# Altium schematic sheet Sheet3.SchDoc
size 300 x 250 mm; SheetNumber: 3; SheetTotal: 3
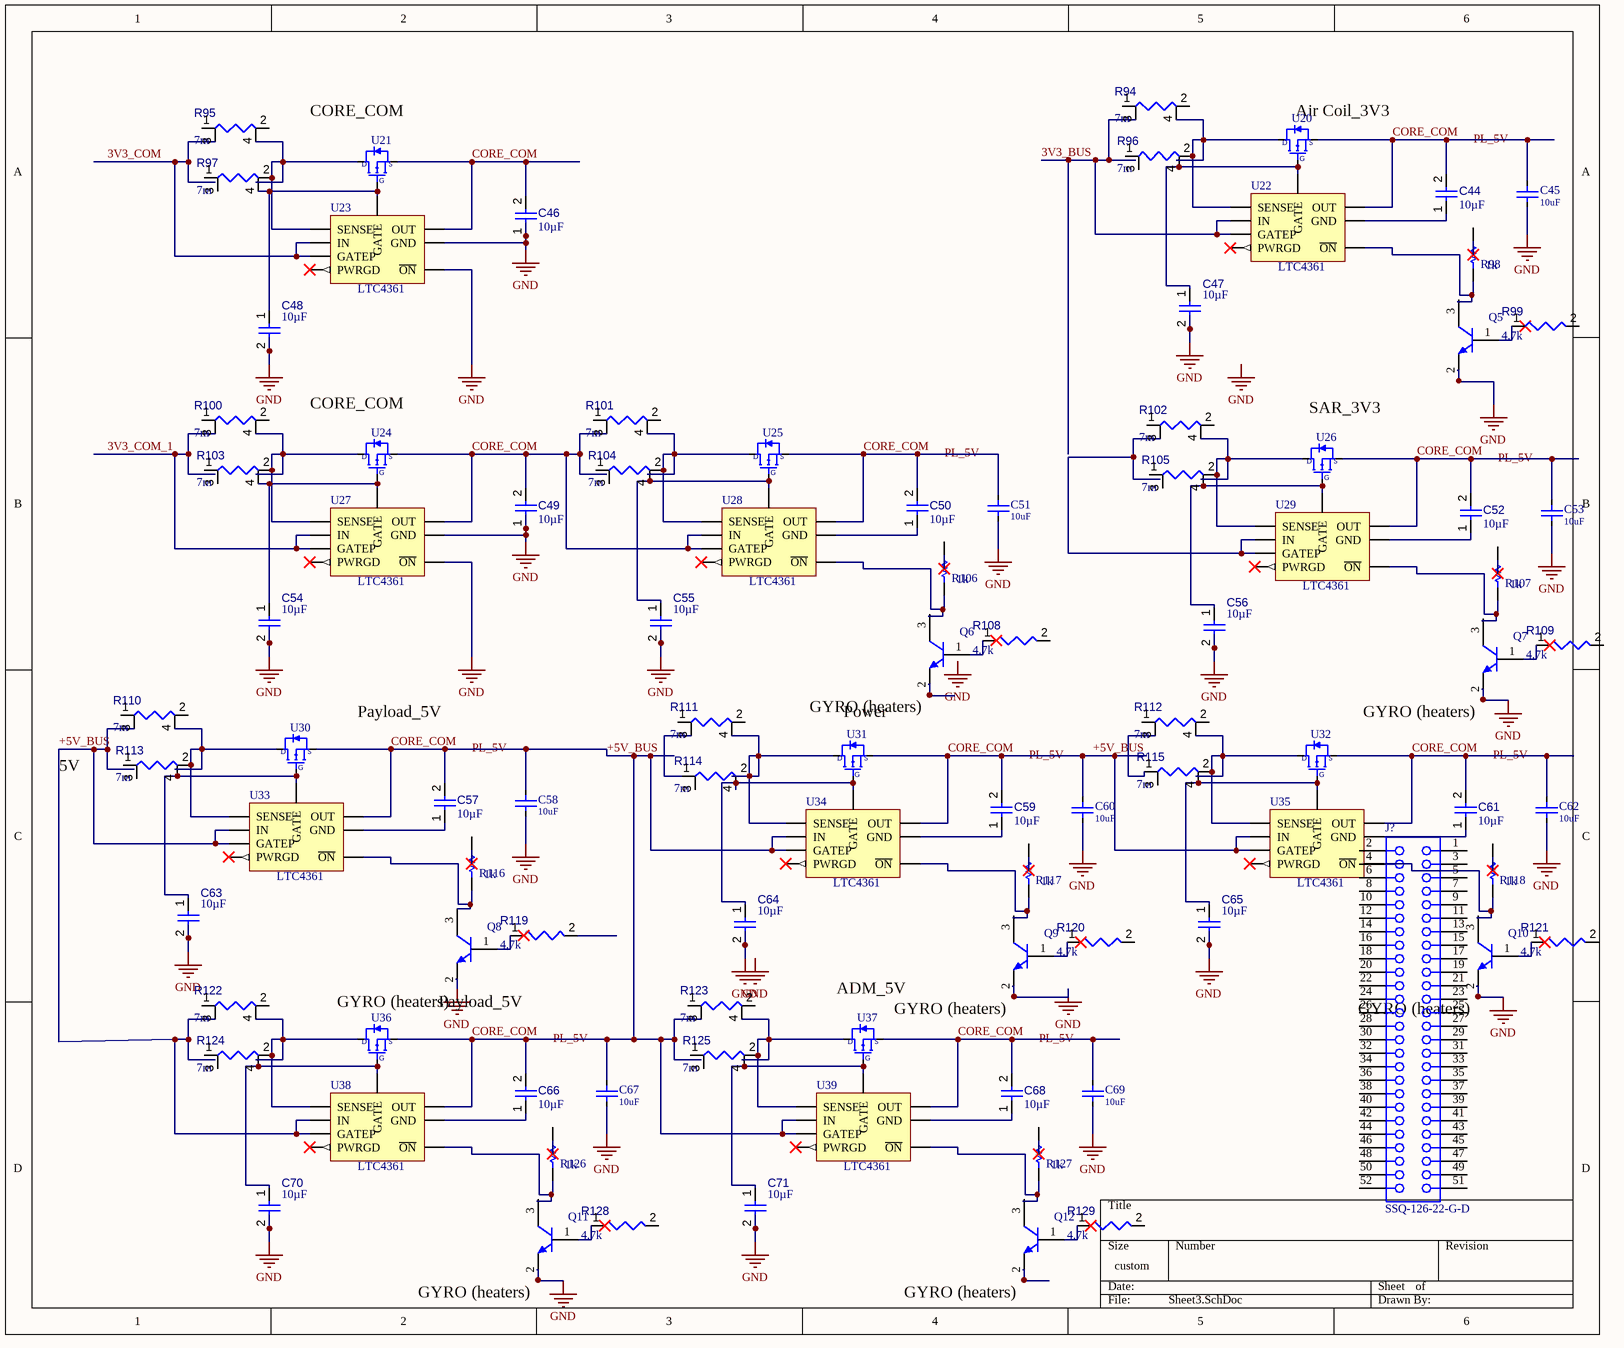
[diagram p0: Sheet3.SchDoc]

## Parts
C44  value 10µF  [CAPC0805(2012)145_L]  (hidden comment: Capacitor 10µF +/-20% 25V 0805)
C45  value 10uF  [CL21B106KOQNNNE]  (hidden comment: CL21B106KOQNNNE)
C46  value 10µF  [CAPC0805(2012)145_L]  (hidden comment: Capacitor 10µF +/-20% 25V 0805)
C47  value 10µF  [CAPC0805(2012)145_L]  (hidden comment: Capacitor 10µF +/-20% 25V 0805)
C48  value 10µF  [CAPC0805(2012)145_L]  (hidden comment: Capacitor 10µF +/-20% 25V 0805)
C49  value 10µF  [CAPC0805(2012)145_L]  (hidden comment: Capacitor 10µF +/-20% 25V 0805)
C50  value 10µF  [CAPC0805(2012)145_L]  (hidden comment: Capacitor 10µF +/-20% 25V 0805)
C51  value 10uF  [CL21B106KOQNNNE]  (hidden comment: CL21B106KOQNNNE)
C52  value 10µF  [CAPC0805(2012)145_L]  (hidden comment: Capacitor 10µF +/-20% 25V 0805)
C53  value 10uF  [CL21B106KOQNNNE]  (hidden comment: CL21B106KOQNNNE)
C54  value 10µF  [CAPC0805(2012)145_L]  (hidden comment: Capacitor 10µF +/-20% 25V 0805)
C55  value 10µF  [CAPC0805(2012)145_L]  (hidden comment: Capacitor 10µF +/-20% 25V 0805)
C56  value 10µF  [CAPC0805(2012)145_L]  (hidden comment: Capacitor 10µF +/-20% 25V 0805)
C57  value 10µF  [CAPC0805(2012)145_L]  (hidden comment: Capacitor 10µF +/-20% 25V 0805)
C58  value 10uF  [CL21B106KOQNNNE]  (hidden comment: CL21B106KOQNNNE)
C59  value 10µF  [CAPC0805(2012)145_L]  (hidden comment: Capacitor 10µF +/-20% 25V 0805)
C60  value 10uF  [CL21B106KOQNNNE]  (hidden comment: CL21B106KOQNNNE)
C61  value 10µF  [CAPC0805(2012)145_L]  (hidden comment: Capacitor 10µF +/-20% 25V 0805)
C62  value 10uF  [CL21B106KOQNNNE]  (hidden comment: CL21B106KOQNNNE)
C63  value 10µF  [CAPC0805(2012)145_L]  (hidden comment: Capacitor 10µF +/-20% 25V 0805)
C64  value 10µF  [CAPC0805(2012)145_L]  (hidden comment: Capacitor 10µF +/-20% 25V 0805)
C65  value 10µF  [CAPC0805(2012)145_L]  (hidden comment: Capacitor 10µF +/-20% 25V 0805)
C66  value 10µF  [CAPC0805(2012)145_L]  (hidden comment: Capacitor 10µF +/-20% 25V 0805)
C67  value 10uF  [CL21B106KOQNNNE]  (hidden comment: CL21B106KOQNNNE)
C68  value 10µF  [CAPC0805(2012)145_L]  (hidden comment: Capacitor 10µF +/-20% 25V 0805)
C69  value 10uF  [CL21B106KOQNNNE]  (hidden comment: CL21B106KOQNNNE)
C70  value 10µF  [CAPC0805(2012)145_L]  (hidden comment: Capacitor 10µF +/-20% 25V 0805)
C71  value 10µF  [CAPC0805(2012)145_L]  (hidden comment: Capacitor 10µF +/-20% 25V 0805)
J?  SSQ-126-22-G-D  [SAMTEC_SSQ-126-X-G-D]
Q5  MMBT3904  [FAIR-SOT23-3_V]  (value not drawn)
Q6  MMBT3904  [FAIR-SOT23-3_V]  (value not drawn)
Q7  MMBT3904  [FAIR-SOT23-3_V]  (value not drawn)
Q8  MMBT3904  [FAIR-SOT23-3_V]  (value not drawn)
Q9  MMBT3904  [FAIR-SOT23-3_V]  (value not drawn)
Q10  MMBT3904  [FAIR-SOT23-3_V]  (value not drawn)
Q11  MMBT3904  [FAIR-SOT23-3_V]  (value not drawn)
Q12  MMBT3904  [FAIR-SOT23-3_V]  (value not drawn)
R94  value 7m  [SUSUMU-3216T4A]  (hidden comment: Resistor 7mR +/-1% 1206 63 mW)
R95  value 7m  [SUSUMU-3216T4A]  (hidden comment: Resistor 7mR +/-1% 1206 63 mW)
R96  value 7m  [SUSUMU-3216T4A]  (hidden comment: Resistor 7mR +/-1% 1206 63 mW)
R97  value 7m  [SUSUMU-3216T4A]  (hidden comment: Resistor 7mR +/-1% 1206 63 mW)
R98  value 1k  [RESC1005X40X25ML05T05]  (hidden comment: Resistor 1k +/-1% 0402 100 mW)
R99  value 4.7k  [RESC2013X70X40ML20T20]  (hidden comment: Resistor 4k7 +/-1% 0805 125 mW)
R100  value 7m  [SUSUMU-3216T4A]  (hidden comment: Resistor 7mR +/-1% 1206 63 mW)
R101  value 7m  [SUSUMU-3216T4A]  (hidden comment: Resistor 7mR +/-1% 1206 63 mW)
R102  value 7m  [SUSUMU-3216T4A]  (hidden comment: Resistor 7mR +/-1% 1206 63 mW)
R103  value 7m  [SUSUMU-3216T4A]  (hidden comment: Resistor 7mR +/-1% 1206 63 mW)
R104  value 7m  [SUSUMU-3216T4A]  (hidden comment: Resistor 7mR +/-1% 1206 63 mW)
R105  value 7m  [SUSUMU-3216T4A]  (hidden comment: Resistor 7mR +/-1% 1206 63 mW)
R106  value 1k  [RESC1005X40X25ML05T05]  (hidden comment: Resistor 1k +/-1% 0402 100 mW)
R107  value 1k  [RESC1005X40X25ML05T05]  (hidden comment: Resistor 1k +/-1% 0402 100 mW)
R108  value 4.7k  [RESC2013X70X40ML20T20]  (hidden comment: Resistor 4k7 +/-1% 0805 125 mW)
R109  value 4.7k  [RESC2013X70X40ML20T20]  (hidden comment: Resistor 4k7 +/-1% 0805 125 mW)
R110  value 7m  [SUSUMU-3216T4A]  (hidden comment: Resistor 7mR +/-1% 1206 63 mW)
R111  value 7m  [SUSUMU-3216T4A]  (hidden comment: Resistor 7mR +/-1% 1206 63 mW)
R112  value 7m  [SUSUMU-3216T4A]  (hidden comment: Resistor 7mR +/-1% 1206 63 mW)
R113  value 7m  [SUSUMU-3216T4A]  (hidden comment: Resistor 7mR +/-1% 1206 63 mW)
R114  value 7m  [SUSUMU-3216T4A]  (hidden comment: Resistor 7mR +/-1% 1206 63 mW)
R115  value 7m  [SUSUMU-3216T4A]  (hidden comment: Resistor 7mR +/-1% 1206 63 mW)
R116  value 1k  [RESC1005X40X25ML05T05]  (hidden comment: Resistor 1k +/-1% 0402 100 mW)
R117  value 1k  [RESC1005X40X25ML05T05]  (hidden comment: Resistor 1k +/-1% 0402 100 mW)
R118  value 1k  [RESC1005X40X25ML05T05]  (hidden comment: Resistor 1k +/-1% 0402 100 mW)
R119  value 4.7k  [RESC2013X70X40ML20T20]  (hidden comment: Resistor 4k7 +/-1% 0805 125 mW)
R120  value 4.7k  [RESC2013X70X40ML20T20]  (hidden comment: Resistor 4k7 +/-1% 0805 125 mW)
R121  value 4.7k  [RESC2013X70X40ML20T20]  (hidden comment: Resistor 4k7 +/-1% 0805 125 mW)
R122  value 7m  [SUSUMU-3216T4A]  (hidden comment: Resistor 7mR +/-1% 1206 63 mW)
R123  value 7m  [SUSUMU-3216T4A]  (hidden comment: Resistor 7mR +/-1% 1206 63 mW)
R124  value 7m  [SUSUMU-3216T4A]  (hidden comment: Resistor 7mR +/-1% 1206 63 mW)
R125  value 7m  [SUSUMU-3216T4A]  (hidden comment: Resistor 7mR +/-1% 1206 63 mW)
R126  value 1k  [RESC1005X40X25ML05T05]  (hidden comment: Resistor 1k +/-1% 0402 100 mW)
R127  value 1k  [RESC1005X40X25ML05T05]  (hidden comment: Resistor 1k +/-1% 0402 100 mW)
R128  value 4.7k  [RESC2013X70X40ML20T20]  (hidden comment: Resistor 4k7 +/-1% 0805 125 mW)
R129  value 4.7k  [RESC2013X70X40ML20T20]  (hidden comment: Resistor 4k7 +/-1% 0805 125 mW)
U20  IRFML8244TRPBF  [SOT23_527AG_ONS]  (value not drawn)
U21  IRFML8244TRPBF  [SOT23_527AG_ONS]  (value not drawn)
U22  LTC4361  [DFN-8_DC_LIT]
U23  LTC4361  [DFN-8_DC_LIT]
U24  IRFML8244TRPBF  [SOT23_527AG_ONS]  (value not drawn)
U25  IRFML8244TRPBF  [SOT23_527AG_ONS]  (value not drawn)
U26  IRFML8244TRPBF  [SOT23_527AG_ONS]  (value not drawn)
U27  LTC4361  [DFN-8_DC_LIT]
U28  LTC4361  [DFN-8_DC_LIT]
U29  LTC4361  [DFN-8_DC_LIT]
U30  IRFML8244TRPBF  [SOT23_527AG_ONS]  (value not drawn)
U31  IRFML8244TRPBF  [SOT23_527AG_ONS]  (value not drawn)
U32  IRFML8244TRPBF  [SOT23_527AG_ONS]  (value not drawn)
U33  LTC4361  [DFN-8_DC_LIT]
U34  LTC4361  [DFN-8_DC_LIT]
U35  LTC4361  [DFN-8_DC_LIT]
U36  IRFML8244TRPBF  [SOT23_527AG_ONS]  (value not drawn)
U37  IRFML8244TRPBF  [SOT23_527AG_ONS]  (value not drawn)
U38  LTC4361  [DFN-8_DC_LIT]
U39  LTC4361  [DFN-8_DC_LIT]

## Nets
GND: C45.1 C46.1 C47.2 C48.2 C49.1 C51.1 C53.1 C54.2 C55.2 C56.2 C58.1 C60.1 C62.1 C63.2 C64.2 C65.2 C67.1 C69.1 C70.2 C71.2 Q5.2(E) Q7.2(E) Q9.2(E) Q10.2(E) Q11.2(E) U23.1(~{ON}) U23.4(GND) U27.1(~{ON}) U27.4(GND)
3V3_BUS: R94.3(E1) U22.3(GATEP) U22.5(IN)
3V3_COM: R95.3(E1) U23.3(GATEP) U23.5(IN)
3V3_COM_1: R100.3(E1) U27.3(GATEP) U27.5(IN)
+5V_BUS: C44.2 C45.2 C46.2 C49.2 C50.2 C51.2 C52.2 C53.2 C57.2 C58.2 C59.2 C60.2 C61.2 C62.2 C66.2 C67.2 C68.2 C69.2 R101.3(E1) R110.3(E1) R122.3(E1) R123.3(E1) U20.2(S) U21.2(S) U22.2(OUT) U23.2(OUT) U24.2(S) U25.2(S) U26.2(S) U27.2(OUT) U28.2(OUT) U28.3(GATEP) U28.5(IN) U29.2(OUT) U30.2(S) U31.2(S) U32.2(S) U33.2(OUT) U33.3(GATEP) U33.5(IN) U34.2(OUT) U34.3(GATEP) U34.5(IN) U35.2(OUT) U35.3(GATEP) U35.5(IN) U36.2(S) U37.2(S) U38.2(OUT) U38.3(GATEP) U38.5(IN) U39.2(OUT) U39.3(GATEP) U39.5(IN)  [also labelled CORE_COM]
NetC44_1: C44.1 U22.4(GND)
NetC47_1: C47.1 R96.4(E2) U20.1(G) U22.7(GATE)
NetC48_1: C48.1 R97.4(E2) U21.1(G) U23.7(GATE)
NetC50_1: C50.1 U28.4(GND)
NetC52_1: C52.1 U29.4(GND)
NetC54_1: C54.1 R103.4(E2) U24.1(G) U27.7(GATE)
NetC55_1: C55.1 R104.4(E2) U25.1(G) U28.7(GATE)
NetC56_1: C56.1 R105.4(E2) U26.1(G) U29.7(GATE)
NetC57_1: C57.1 U33.4(GND)
NetC59_1: C59.1 U34.4(GND)
NetC61_1: C61.1 U35.4(GND)
NetC63_1: C63.1 R113.4(E2) U30.1(G) U33.7(GATE)
NetC64_1: C64.1 R114.4(E2) U31.1(G) U34.7(GATE)
NetC65_1: C65.1 R115.4(E2) U32.1(G) U35.7(GATE)
NetC66_1: C66.1 U38.4(GND)
NetC68_1: C68.1 U39.4(GND)
NetC70_1: C70.1 R124.4(E2) U36.1(G) U38.7(GATE)
NetC71_1: C71.1 R125.4(E2) U37.1(G) U39.7(GATE)
NetQ5_1: Q5.1(B) R99.1
NetQ6_1: Q6.1(B) R108.1
NetQ7_1: Q7.1(B) R109.1
NetQ8_1: Q8.1(B) R119.1
NetQ8_3: Q8.3(C) R116.1 U33.1(~{ON})
NetQ9_1: Q9.1(B) R120.1
NetQ10_1: Q10.1(B) R121.1
NetQ11_1: Q11.1(B) R128.1
NetQ12_1: Q12.1(B) R129.1
NetR94_4: R94.4(E2) R96.2(I2) U20.3(D) U22.6(SENSE)
NetR95_4: R95.4(E2) R97.2(I2) U21.3(D) U23.6(SENSE)
NetR98_1: R98.1 U22.1(~{ON})
NetR100_4: R100.4(E2) R103.2(I2) U24.3(D) U27.6(SENSE)
NetR101_4: R101.4(E2) R104.2(I2) U25.3(D) U28.6(SENSE)
NetR102_3: R102.3(E1) U29.3(GATEP) U29.5(IN)
NetR102_4: R102.4(E2) R105.2(I2) U26.3(D) U29.6(SENSE)
NetR106_1: R106.1 U28.1(~{ON})
NetR107_1: R107.1 U29.1(~{ON})
NetR110_4: R110.4(E2) R113.2(I2) U30.3(D) U33.6(SENSE)
NetR111_3: R111.3(E1) R114.1(I1)
NetR111_4: R111.4(E2) R114.2(I2) U31.3(D) U34.6(SENSE)
NetR112_3: R112.3(E1) R115.1(I1)
NetR112_4: R112.4(E2) R115.2(I2) U32.3(D) U35.6(SENSE)
NetR117_1: R117.1 U34.1(~{ON})
NetR118_1: R118.1 U35.1(~{ON})
NetR122_4: R122.4(E2) R124.2(I2) U36.3(D) U38.6(SENSE)
NetR123_4: R123.4(E2) R125.2(I2) U37.3(D) U39.6(SENSE)
NetR126_1: R126.1 U38.1(~{ON})
NetR127_1: R127.1 U39.1(~{ON})

Not connected (* = marked no-connect by the designer): J? 1 2 3 4 5 6 7 8 9 10 11 12 13 14 15 16 17 18 19 20 21 22 23 24 25 26 27 28 29 30 31 32 33 34 35 36 37 38 39 40 41 42 43 44 45 46 47 48 49 50 51 52; Q5 3(C); Q6 2(E) 3(C); Q7 3(C); Q8 2(E); Q9 3(C); Q10 3(C); Q11 3(C); Q12 2(E) 3(C); R94 1(I1) 2(I2); R95 1(I1) 2(I2); R96 1(I1) 3(E1); R97 1(I1) 3(E1); R98 2; R99 2; R100 1(I1) 2(I2); R101 1(I1) 2(I2); R102 1(I1) 2(I2); R103 1(I1) 3(E1); R104 1(I1) 3(E1); R105 1(I1) 3(E1); R106 2; R107 2; R108 2; R109 2; R110 1(I1) 2(I2); R111 1(I1) 2(I2); R112 1(I1) 2(I2); R113 1(I1) 3(E1); R114 3(E1); R115 3(E1); R116 2; R117 2; R118 2; R119 2; R120 2; R121 2; R122 1(I1) 2(I2); R123 1(I1) 2(I2); R124 1(I1) 3(E1); R125 1(I1) 3(E1); R126 2; R127 2; R128 2; R129 2; U22 8(PWRGD)*; U23 8(PWRGD)*; U27 8(PWRGD)*; U28 8(PWRGD)*; U29 8(PWRGD)*; U33 8(PWRGD)*; U34 8(PWRGD)*; U35 8(PWRGD)*; U38 8(PWRGD)*; U39 8(PWRGD)*

## Notes on the sheet
- CORE_COM
- (near U20) Air Coil_3V3
- (near U26) SAR_3V3
- Payload_5V
- GYRO (heaters)
- (near U31) Power
- 5V
- (near Q8) Payload_5V
- (near U37) ADM_5V
- (near J?) GYRO (heaters)
- (near Q11) GYRO (heaters)
- (near Q12) GYRO (heaters)
- Labels drawn without touching a wire or pin: GND, PL_5V

## Library data of the parts
C44 C46-C50 C52 C54-C57 C59 C61 C63-C66 C68 C70 C71 = CMP-001-00079-4: Chip Capacitor, 10µF +/-20%, 25V, 0805, Thickness 1.45 mm; Tolerance: 10%; Max Operating Temperature: 85°C; Case/Package: 0805; Voltage Rating: 25V; Min Operating Temperature: -55°C; Mounting Technology: SMT; Pins: 2
C45 C51 C53 C58 C60 C62 C67 C69 = CL21B106KOQNNNE: CAP CER 10UF 16V X7R 0805; Manufacturer: Samsung Electro-Mechanics; Tolerance: ±10%; Notification: Current market demand for these product types have resulted in fluctuating and extending lead times. Lead times may differ.; Supplier 1: Digi-Key; Manufacturer Part Number: CL21B106KOQNNNE; RoHS: RoHS Compliant; Category: Capacitors; Stock 1: 25; Pricing 1: 1=0.34, 10=0.232, 100=0.1313, 500=0.0927, 1000=0.08111 (USD); Packaging: Cut Tape (CT); Part Status: Active; Voltage - Rated: 16V; Temperature Coefficient: X7R; Operating Temperature: -55°C ~ 125°C; Features: -; Ratings: -; Applications: General Purpose; Mounting Type: Surface Mount, MLCC; Package / Case: 0805 (2012 Metric); Size / Dimension: 0.079" L x 0.049" W (2.00mm x 1.25mm); Height - Seated (Max): -; Thickness (Max): 0.055" (1.40mm); Lead Spacing: -; Lead Style: -; ComponentLink1URL: http://www.samsungsem.com/kr/support/product-search/mlcc/CL21B106KOQNNNE.jsp; ComponentLink1Description: http://www.samsungsem.com/kr/support/product-search/mlcc/CL21B106KOQNNNE.jsp; Supplier Part Number 1: 1276-2872-1-ND
J? = SSQ-126-22-G-D: SQ Post Socket, Through-hole, Vertical, -55 to 125 degC, 2.54 mm Pitch, 52-Pin, Female, RoHS; Manufacturer: Samtec; Pitch: 2.54 mm; ComponentLink1Description: Manufacturer URL; ComponentLink2Description: Datasheet; Orientation: Vertical; ComponentLink3Description: Package Specification; ComponentLink3URL: http://www.samtec.com/documents/webfiles/cpdf/SSQ-1XX-XX-XXX-X-XX-XXX-XX-X-MKT.pdf; DatasheetVersion: F-214; ComponentLink1URL: http://www.samtec.com; ComponentLink2URL: http://www.samtec.com/documents/webfiles/pdf/SSQ_TH.PDF; PackageVersion: BD, 6/1987; Temperature Range: -55 to 125 degC; PartNumber: SSQ-126-22-G-D; PackageDescription: Assembly, Socket Strip .025[0.64] SQ Tail; Mounting Technology: Through-hole; RoHS: True; PackageReference: SSQ-126-22-X-D
Q5-Q12 = CMP-014-00026-2: NPN General Purpose Amplifier, 40 V, 0.2 A, -55 to 150 degC, 3-Pin SOT23, RoHS, Tape and Reel; Manufacturer: Fairchild Semiconductor; Package Version: Rev. 12, 03/2016; Elements: 1; Power: 625mW; hFE Min: 100; Vce Max: 300mV; Frequency: 300MHz; Packaging: TapeandReel; Pins: 3; Package Description: 3-Pin Small Outline Transistor, Body 2.92 x 1.325 mm, Pitch 0.95 mm; RoHS Compliant: True; Package Quantity: 3000; Manufacturer URL: https://www.fairchildsemi.com/; Min Operating Temperature: -55°C; Max Operating Temperature: 150°C; Mounting Technology: SM; Case/Package: TO-236-3; Package Reference: SOT23-3; Datasheet Version: Rev. 1.1.0, 10/2014; Datasheet URL: https://www.fairchildsemi.com/datasheets/MM/MMBT3904.pdf; Package URL: http://www.fairchildsemi.com/dwg/MA/MA03D.pdf
R94-R97 R100-R105 R110-R115 R122-R125 = CMP-009-00119-3: Chip Resistor, 0,007 Ohms, +/-1%, 63 mW, -55 to 155 degC, 1206; Tolerance: 1%; Max Operating Temperature: 155°C; Min Operating Temperature: -55°C; Pins: 4; Case/Package: 1206
R98 R106 R107 R116-R118 R126 R127 = CMP-009-00009-5: Chip Resistor, 1 KOhm, +/- 1%, 0.1 W, -55 to 155 degC, 0402 (1005 Metric); Voltage Rating: 50V; Power: 100mW; Case/Package: 0402; Min Operating Temperature: -55°C; Max Operating Temperature: 155°C; Tolerance: 1%; RoHS Compliant: True; Mounting Technology: SM; Pins: 2
R99 R108 R109 R119-R121 R128 R129 = CMP-009-00032-5: Chip Resistor, 4.7 KOhm, +/- 1%, 0.125 W, -55 to 155 degC, 0805 (2012 Metric); Power: 125mW; Voltage Rating: 150V; Tolerance: 1%; Max Operating Temperature: 155°C; Min Operating Temperature: -55°C; Case/Package: 0805; RoHS Compliant: True; Pins: 2; Mounting Technology: SM
U20 U21 U24-U26 U30-U32 U36 U37 = IRFML8244TRPBF: MOSFET N-CH 25V 5.8A SOT23; Manufacturer: International Rectifier; Rise Time: 2.1ns; Gate to Source Voltage (Vgs): 20V; Turn-On Delay Time: 2.7ns; Turn-Off Delay Time: 9ns; Fall Time: 2.9ns; Nominal Vgs: 1.7V; Rds On Max: 24mR; Input Capacitance: 430pF; Max Power Dissipation: 1.25W; Number of Elements: 1; Drain to Source Resistance: 41mR; Element Configuration: Single; Recovery Time: 17ns; Supplier 1: Digi-Key; Supplier Part Number 1: IRFML8244TRPBFCT-ND; Manufacturer Part Number: IRFML8244TRPBF; Stock 1: 12011; Pricing 1: 1=0.47, 10=0.357, 25=0.3216, 100=0.1697, 500=0.1503, 1000=0.117 (USD); Mount: Surface Mount; Case/Package: SOT-23; Number of Pins: 3; Min Operating Temperature: -55°C; Max Operating Temperature: 150°C; Continuous Drain Current (ID): 5.8A; Packaging: Tape and Reel; Package Quantity: 1; Drain to Source Breakdown Voltage: 25V; Power Dissipation: 1.25W; Drain to Source Voltage (Vdss): 25V; Threshold Voltage: 1.7V; On-State Resistance: 41MR; Length: 3.04mm; Height: 1.02mm; Width: 1.4mm; Radiation Hardening: No; REACH SVHC: No SVHC; Lead Free: Lead Free; ComponentLink1URL: http://farnell.com//datasheets/1911843.pdf?src-supplier=Farnell; ComponentLink1Description: http://farnell.com//datasheets/1911843.pdf?src-supplier=Farnell
U22 U23 U27-U29 U33-U35 U38 U39 = LTC4361HTS8-2#TRMPBF: IC OVERVOLT PROT CONT TSOT23-8; Manufacturer: Linear Technology; Manufacturer Part Number: LTC4361ITS8-2#TRMPBF; Current - Supply: 220µA; Voltage - Supply: 2.5 V ~ 80 V; Supplier 1: Digi-Key; RoHS: RoHS Compliant; Category: Integrated Circuits (ICs); Stock 1: 1487; Pricing 1: 1=3.87, 25=3.4596, 100=2.2889, 250=2.09816 (USD); Packaging: Cut Tape (CT); Part Status: Active; Applications: Handheld/Mobile Devices; Operating Temperature: -40°C ~ 85°C; Mounting Type: Surface Mount; Package / Case: SOT-23-8 Thin, TSOT-23-8; Supplier Device Package: TSOT-23-8; Base Part Number: LTC4361-2; ComponentLink1URL: http://www.linear.com/docs/29266; ComponentLink1Description: http://www.linear.com/docs/29266; Supplier Part Number 1: LTC4361ITS8-2#TRMPBFCT-ND